# EAGLE schematic board (EAGLE 7.6.0)
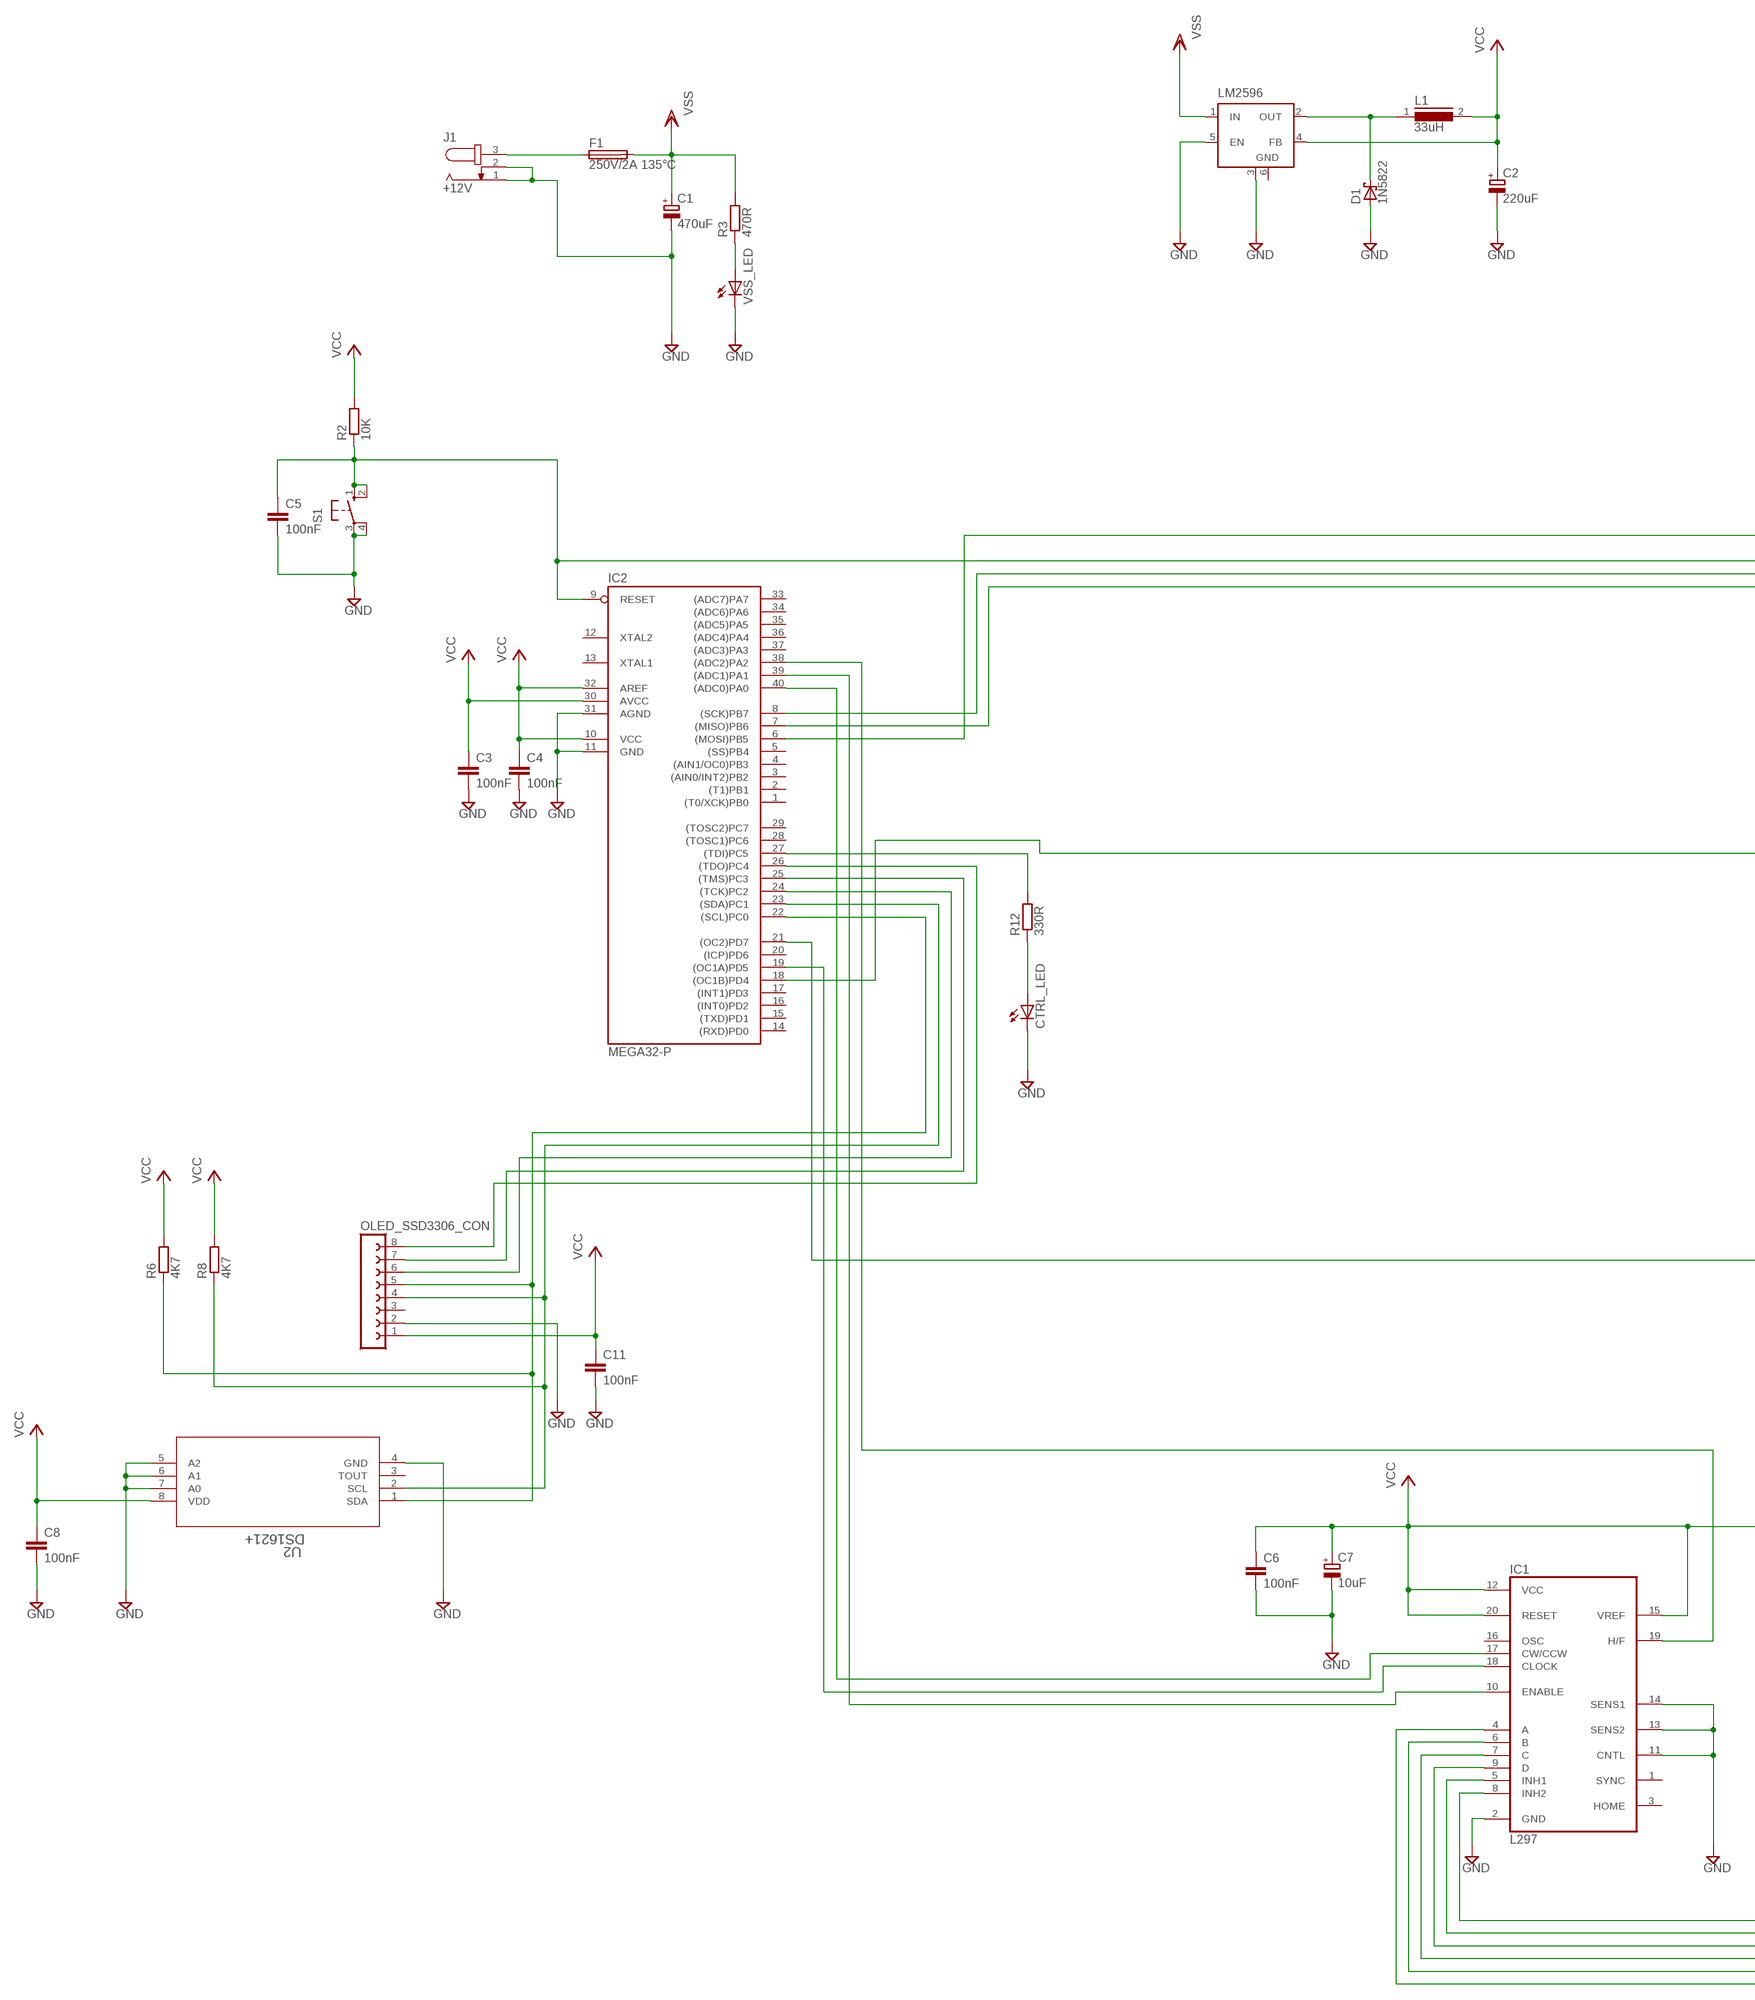
[diagram p0: schematic, sheet 1, part 1 of 2]
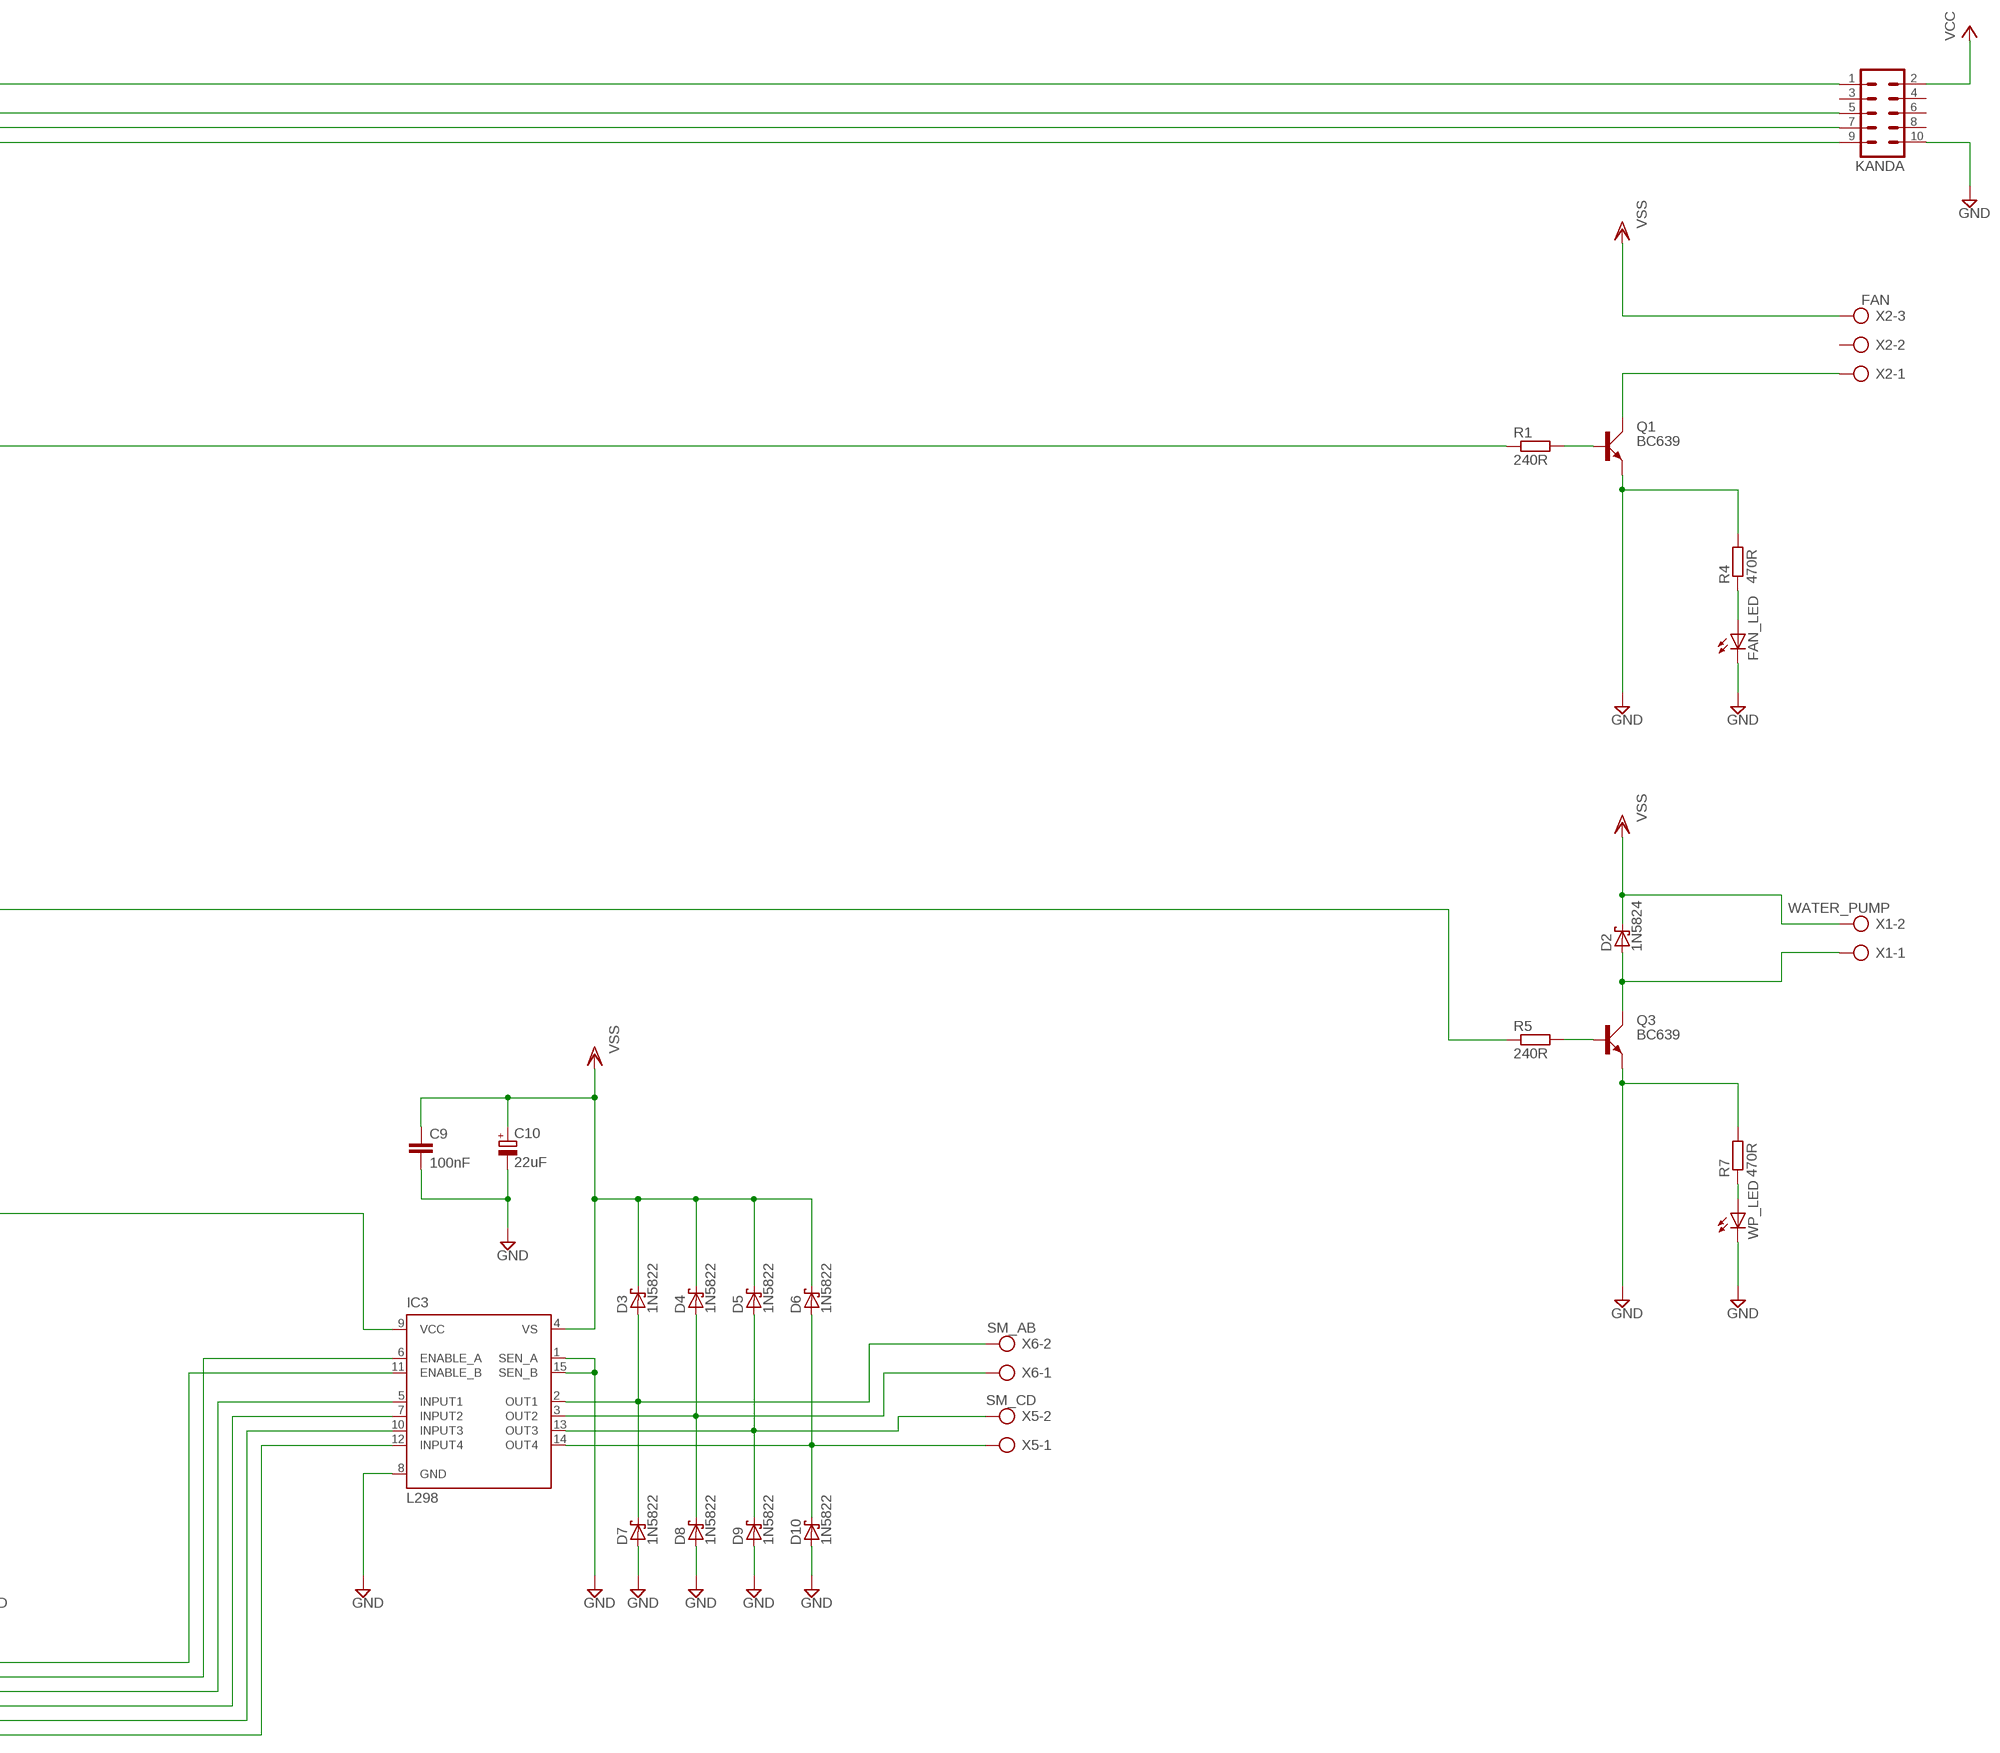
[diagram p1: schematic, sheet 1, part 2 of 2]

## Parts
C1  470uF  CPOL-EUE5-10.5  [E5-10,5]
C2  220uF  CPOL-EUE5-10.5  [E5-10,5]
C3  100nF  C-EU025-025X050  [C025-025X050]
C4  100nF  C-EU025-025X050  [C025-025X050]
C5  100nF  C-EU025-025X050  [C025-025X050]
C6  100nF  C-EU025-025X050  [C025-025X050]
C7  10uF  CPOL-EUE5-10.5  [E5-10,5]
C8  100nF  C-EU025-025X050  [C025-025X050]
C9  100nF  C-EU025-025X050  [C025-025X050]
C10  22uF  CPOL-EUE5-10.5  [E5-10,5]
C11  100nF  C-EU025-025X050  [C025-025X050]
CTRL_LED  LED5MM  [LED5MM]
D1  1N5822  1N5819-B  [DO41-7.6]
D2  1N5824  1N5819-B  [DO41-7.6]
D3  1N5822  1N5819-B  [DO41-7.6]
D4  1N5822  1N5819-B  [DO41-7.6]
D5  1N5822  1N5819-B  [DO41-7.6]
D6  1N5822  1N5819-B  [DO41-7.6]
D7  1N5822  1N5819-B  [DO41-7.6]
D8  1N5822  1N5819-B  [DO41-7.6]
D9  1N5822  1N5819-B  [DO41-7.6]
D10  1N5822  1N5819-B  [DO41-7.6]
F1  250V/2A 135°C  FUSE19560  [19560]
FAN_LED  LED5MM  [LED5MM]
IC1  L297  [DIL20]
IC2  MEGA32-P  [DIL40]
IC3  L298  [MULTIWATT-15]
J1  +12V  JACK-PLUG1  [SPC4078]
KANDA  ML10  [ML10]
L1  33uH  BC12  [BC12]
LM2596  LM2596S  [TO263-5]
OLED_SSD3306_CON  FE08-1  [FE08]
Q1  BC639  [SOT54D]
Q3  BC639  [SOT54D]
R1  240R  R-EU_0207/12  [0207/12]
R2  10K  R-EU_0207/12  [0207/12]
R3  470R  R-EU_0207/12  [0207/12]
R4  470R  R-EU_0207/12  [0207/12]
R5  240R  R-EU_0207/12  [0207/12]
R6  4K7  R-EU_0207/12  [0207/12]
R7  470R  R-EU_0207/12  [0207/12]
R8  4K7  R-EU_0207/12  [0207/12]
R12  330R  R-EU_0207/12  [0207/12]
S1  10-XX  [B3F-10XX]
U2  DS1621+  [21-0043D_8]
VSS_LED  LED5MM  [LED5MM]
WP_LED  LED5MM  [LED5MM]
X1  WATER_PUMP  AK500/2  [AK500/2]
X2  FAN  AK500/3  [AK500/3]
X5  SM_CD  AK500/2  [AK500/2]
X6  SM_AB  AK500/2  [AK500/2]

## Nets
GND: C1.- C2.- C3.2 C4.2 C5.2 C6.2 C7.- C8.2 C9.2 C10.- C11.2 CTRL_LED.K(C) D1.A D7.A D8.A D9.A D10.A FAN_LED.K(C) IC1.2(GND) IC1.11(CNTL) IC1.13(SENS2) IC1.14(SENS1) IC2.11(GND) IC2.31(AGND) IC3.1(SEN_A) IC3.8(GND) IC3.15(SEN_B) J1.1 J1.2 KANDA.10 LM2596.3(GND) LM2596.5(EN) OLED_SSD3306_CON.2 Q1.E Q3.E R4.2 R7.2 S1.3(P) S1.4(P1) U2.4(GND) U2.5(A2) U2.6(A1) U2.7(A0) VSS_LED.K(C) WP_LED.K(C)
N$1: F1.1 J1.3
N$2: D1.C L1.1 LM2596.2(OUT)
N$3: IC2.6((MOSI)PB5) KANDA.1
N$4: IC2.8((SCK)PB7) KANDA.7
N$6: IC2.7((MISO)PB6) KANDA.9
N$7: R3.1 VSS_LED.A
N$8: Q1.B R1.2
N$9: Q1.C X2.1
N$10: C5.1 IC2.9(RESET) KANDA.5 R2.1 S1.1(S) S1.2(S1)
N$11: IC2.27((TDI)PC5) R12.2
N$12: IC2.21((OC2)PD7) R5.1
N$13: IC1.9(D) IC3.5(INPUT1)
N$14: CTRL_LED.A R12.1
N$15: IC1.5(INH1) IC3.6(ENABLE_A)
N$16: IC1.4(A) IC3.12(INPUT4)
N$17: IC1.17(CW/CCW) IC2.40((ADC0)PA0)
N$18: IC1.18(CLOCK) IC2.19((OC1A)PD5)
N$19: IC1.10(ENABLE) IC2.39((ADC1)PA1)
N$20: IC1.19(H/F) IC2.38((ADC2)PA2)
N$21: IC1.8(INH2) IC3.11(ENABLE_B)
N$22: R7.1 WP_LED.A
N$23: FAN_LED.A R4.1
N$24: D6.A D10.C IC3.14(OUT4) X5.1
N$25: D3.A D7.C IC3.2(OUT1) X6.2
N$26: D4.A D8.C IC3.3(OUT2) X6.1
N$27: D5.A D9.C IC3.13(OUT3) X5.2
N$28: Q3.B R5.2
N$29: D2.A Q3.C X1.1
N$31: IC2.18((OC1B)PD4) R1.1
N$35: IC2.23((SDA)PC1) OLED_SSD3306_CON.4 R8.1 U2.2(SCL)
N$36: IC2.22((SCL)PC0) OLED_SSD3306_CON.5 R6.1 U2.1(SDA)
N$37: IC2.24((TCK)PC2) OLED_SSD3306_CON.6
N$38: IC2.25((TMS)PC3) OLED_SSD3306_CON.7
N$39: IC2.26((TDO)PC4) OLED_SSD3306_CON.8
N$56: IC1.7(C) IC3.7(INPUT2)
N$58: IC1.6(B) IC3.10(INPUT3)
VCC: C2.+ C3.1 C4.1 C6.1 C7.+ C8.1 C11.1 IC1.12(VCC) IC1.15(VREF) IC1.20(RESET) IC2.10(VCC) IC2.30(AVCC) IC2.32(AREF) IC3.9(VCC) KANDA.2 L1.2 LM2596.4(FB) OLED_SSD3306_CON.1 R2.2 R6.2 R8.2 U2.8(VDD)
VSS: C1.+ C9.1 C10.+ D2.C D3.C D4.C D5.C D6.C F1.2 IC3.4(VS) LM2596.1(IN) R3.2 X1.2 X2.3
Unconnected: IC1.1(SYNC) IC1.3(HOME) IC1.16(OSC) IC2.1((T0/XCK)PB0) IC2.2((T1)PB1) IC2.3((AIN0/INT2)PB2) IC2.4((AIN1/OC0)PB3) IC2.5((SS)PB4) IC2.12(XTAL2) IC2.13(XTAL1) IC2.14((RXD)PD0) IC2.15((TXD)PD1) IC2.16((INT0)PD2) IC2.17((INT1)PD3) IC2.20((ICP)PD6) IC2.28((TOSC1)PC6) IC2.29((TOSC2)PC7) IC2.33((ADC7)PA7) IC2.34((ADC6)PA6) IC2.35((ADC5)PA5) IC2.36((ADC4)PA4) IC2.37((ADC3)PA3) KANDA.3 KANDA.4 KANDA.6 KANDA.8 OLED_SSD3306_CON.3 U2.3(TOUT) X2.2

## Power pins joined to a net without a drawn wire
GND: LM2596.6(GND)

## Library data of the parts
C1 C2 C7 C10 = resistor:CPOL-EU: POLARIZED CAPACITOR, European symbol
C3-C6 C8 C9 C11 = rcl:C-EU: CAPACITOR, European symbol; SPICEPREFIX: C
CTRL_LED FAN_LED VSS_LED WP_LED = led:LED: LED OSRAM: - CHIPLED LG R971, LG N971, LY N971, LG Q971, LY Q971, LO R971, LY R971 LH N974, LH R974 LS Q976, LO Q976, LY Q976 LO Q996 - Hyper CHIPLED LW Q18S LB Q993, LB Q99A, LB R99A - SideLED LS A670, LO A670, LY A670, LG A670, LP A670 LB A673, LV A673, LT A673, LW A673 LH A674 LY A675 LS A676, LA A676, LO A676, LY A676, LW A676 LS A679, LY A679, LG A679 - Hyper Micro SIDELED® LS Y876, LA Y876, LO Y876, LY Y876 LT Y87S - SmartLED LW L88C, LW L88S LB L89C, LB L89S, LG L890 LS L89K, LO L89K, LY L89K LS L896, LA L896, LO L896, LY L896 - TOPLED LS T670, LO T670, LY T670, LG T670, LP T670 LSG T670, LSP T670, LSY T670, LOP T670, LYG T670 LG T671, LOG T671, LSG T671 LB T673, LV T673, LT T673, LW T673 LH T674 LS T676, LA T676, LO T676, LY T676, LB T676, LH T676, LSB T676, LW T676 LB T67C, LV T67C, LT T67C, LS T67K, LO T67K, LY T67K, LW E67C LS E67B, LA E67B, LO E67B, LY E67B, LB E67C, LV E67C, LT E67C LW T67C LS T679, LY T679, LG T679 LS T770, LO T770, LY T770, LG T770, LP T770 LB T773, LV T773, LT T773, LW T773 LH T774 LS E675, LA E675, LY E675, LS T675 LS T776, LA T776, LO T776, LY T776, LB T776 LHGB T686 LT T68C, LB T68C - Hyper Mini TOPLED® LB M676 - Mini TOPLED Santana® LG M470 LS M47K, LO M47K, LY M47K Source: http://www.osram.convergy.de/
D1-D10 = diode:1N581*: 1.0A SCHOTTKY BARRIER RECTIFIER Source: http://www.diodes.com/datasheets/ds23001.pdf
F1 = fuse:FUSE: Fuse; MPN: 56000001009; OC_FARNELL: 1185363; OC_NEWARK: 98K6125
IC1 = st-microelectronics:L297: STEPPER MOTOR CONTROLLER; MPN: L297/1; OC_FARNELL: 1094209; OC_NEWARK: 56P8258
IC2 = avr-7:MEGA32-P: MICROCONTROLLER 32 Kbytes FLASH 2 Kbytes SRAM 1 Kbytes EEPROM USART 8-channel 10 bit ADC
IC3 = st-microelectronics:L298: DUAL FULL-BRIDGE DRIVER
J1 = con-jack:JACK-PLUG: DC POWER JACK Power Jack, DC, Right Angle, Through Hole, Rated 5A at 16VDC, PC Terminals Distributor: Farnell (www.Farnell.de) Drawing: 84N1161.pdf / 84N1162.pdf Manufacturer: SPC Technology (www.spctechnology.com) Type: SPC4077 / SPC 4078; OC_FARNELL: unknown; OC_NEWARK: unknown
KANDA = con-ml:ML10: HARTING; OC_FARNELL: unknown; OC_NEWARK: unknown
L1 = inductors:BC12: INDUCTOR
LM2596 = linear:LM2596S: STEP-DOWN VOLTAGE REGULATOR
OLED_SSD3306_CON = con-lsta:FE08-1: FEMALE HEADER; OC_FARNELL: unknown; OC_NEWARK: unknown
Q1 Q3 = transistor-small-signal:BC639: NPN TRANSISTOR
R1-R8 R12 = rcl:R-EU_: RESISTOR, European symbol; SPICEPREFIX: R
S1 = switch-omron:10-XX: OMRON SWITCH; MPN: B3F-1000; OC_FARNELL: 176432; OC_NEWARK: 36M3542
U2 = ds1621p:DS1621+; MANUFACTURER_PART_NUMBER: DS1621+; VENDOR: Maxim Integrated Products
X1 X5 X6 = con-ptr500:AK500/2: CONNECTOR; OC_FARNELL: unknown; OC_NEWARK: unknown
X2 = con-ptr500:AK500/3: CONNECTOR; OC_FARNELL: unknown; OC_NEWARK: unknown